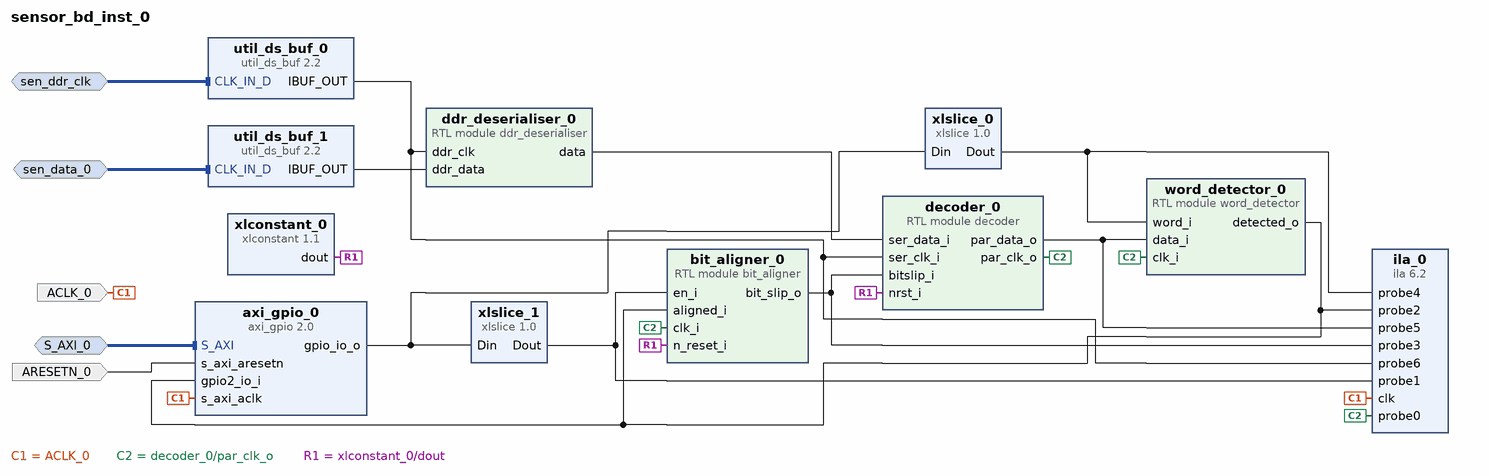
[diagram p0: block diagram of the top level]
# Vivado block design sensor_bd_inst_0, xc7z020clg484-2, Vivado 2023.2
create_bd_design sensor_bd_inst_0

create_bd_intf_port -mode Slave -vlnv xilinx.com:interface:aximm_rtl:1.0 S_AXI_0
create_bd_intf_port -mode Slave -vlnv xilinx.com:interface:diff_clock_rtl:1.0 sen_ddr_clk
create_bd_intf_port -mode Slave -vlnv xilinx.com:interface:diff_clock_rtl:1.0 sen_data_0
create_bd_port -dir I -type clk ACLK_0
create_bd_port -dir I -type rst ARESETN_0

create_bd_cell -type ip -vlnv xilinx.com:ip:axi_gpio:2.0 axi_gpio_0
set_property -dict [list \
  CONFIG.C_ALL_INPUTS 0 \
  CONFIG.C_ALL_INPUTS_2 1 \
  CONFIG.C_ALL_OUTPUTS 1 \
  CONFIG.C_GPIO2_WIDTH 1 \
  CONFIG.C_GPIO_WIDTH 13 \
  CONFIG.C_IS_DUAL 1 \
] [get_bd_cells axi_gpio_0]
create_bd_cell -type ip -vlnv xilinx.com:ip:util_ds_buf:2.2 util_ds_buf_0
create_bd_cell -type ip -vlnv xilinx.com:ip:util_ds_buf:2.2 util_ds_buf_1
create_bd_cell -type ip -vlnv xilinx.com:ip:xlslice:1.0 xlslice_0
set_property -dict {CONFIG.DIN_FROM 11 CONFIG.DIN_WIDTH 13} [get_bd_cells xlslice_0]
create_bd_cell -type ip -vlnv xilinx.com:ip:xlslice:1.0 xlslice_1
set_property -dict {CONFIG.DIN_FROM 12 CONFIG.DIN_TO 12 CONFIG.DIN_WIDTH 13} [get_bd_cells xlslice_1]
create_bd_cell -type ip -vlnv xilinx.com:ip:ila:6.2 ila_0
set_property -dict [list \
  CONFIG.C_DATA_DEPTH 8192 \
  CONFIG.C_MONITOR_TYPE Native \
  CONFIG.C_NUM_OF_PROBES 7 \
  CONFIG.C_PROBE2_WIDTH 1 \
  CONFIG.C_PROBE3_WIDTH 1 \
  CONFIG.C_PROBE4_WIDTH 12 \
  CONFIG.C_PROBE5_WIDTH 12 \
] [get_bd_cells ila_0]
create_bd_cell -type module -reference word_detector word_detector_0
create_bd_cell -type module -reference bit_aligner bit_aligner_0
set_property -dict {CONFIG.HOLD_OFF_CYCLES 32} [get_bd_cells bit_aligner_0]
create_bd_cell -type module -reference decoder decoder_0
set_property -dict {CONFIG.DIV 12} [get_bd_cells decoder_0]
create_bd_cell -type module -reference ddr_deserialiser ddr_deserialiser_0
create_bd_cell -type ip -vlnv xilinx.com:ip:xlconstant:1.1 xlconstant_0

# ---- connections ----

connect_bd_intf_net -intf_net CLK_IN_D_0_1 [get_bd_intf_ports sen_data_0] [get_bd_intf_pins util_ds_buf_1/CLK_IN_D]
connect_bd_intf_net -intf_net S_AXI_0_1 [get_bd_intf_ports S_AXI_0] [get_bd_intf_pins axi_gpio_0/S_AXI]
connect_bd_intf_net -intf_net diff_clk_in_0_1 [get_bd_intf_ports sen_ddr_clk] [get_bd_intf_pins util_ds_buf_0/CLK_IN_D]
connect_bd_net -net ACLK_0_1 [get_bd_ports ACLK_0] [get_bd_pins axi_gpio_0/s_axi_aclk] [get_bd_pins ila_0/clk]
connect_bd_net -net ARESETN_0_1 [get_bd_ports ARESETN_0] [get_bd_pins axi_gpio_0/s_axi_aresetn]
connect_bd_net [get_bd_pins axi_gpio_0/gpio_io_o] [get_bd_pins xlslice_0/Din] [get_bd_pins xlslice_1/Din]
connect_bd_net [get_bd_pins bit_aligner_0/bit_slip_o] [get_bd_pins decoder_0/bitslip_i] [get_bd_pins ila_0/probe3]
connect_bd_net [get_bd_pins ddr_deserialiser_0/data] [get_bd_pins decoder_0/ser_data_i]
connect_bd_net [get_bd_pins decoder_0/par_clk_o] [get_bd_pins word_detector_0/clk_i] [get_bd_pins bit_aligner_0/clk_i] [get_bd_pins ila_0/probe0]
connect_bd_net [get_bd_pins decoder_0/par_data_o] [get_bd_pins word_detector_0/data_i] [get_bd_pins ila_0/probe5]
connect_bd_net [get_bd_pins util_ds_buf_0/IBUF_OUT] \
  [get_bd_pins decoder_0/ser_clk_i] [get_bd_pins ddr_deserialiser_0/ddr_clk] [get_bd_pins ila_0/probe6]
connect_bd_net [get_bd_pins util_ds_buf_1/IBUF_OUT] [get_bd_pins ddr_deserialiser_0/ddr_data]
connect_bd_net [get_bd_pins word_detector_0/detected_o] \
  [get_bd_pins bit_aligner_0/aligned_i] [get_bd_pins ila_0/probe2] [get_bd_pins axi_gpio_0/gpio2_io_i]
connect_bd_net [get_bd_pins xlconstant_0/dout] [get_bd_pins decoder_0/nrst_i] [get_bd_pins bit_aligner_0/n_reset_i]
connect_bd_net [get_bd_pins xlslice_0/Dout] [get_bd_pins word_detector_0/word_i] [get_bd_pins ila_0/probe4]
connect_bd_net [get_bd_pins xlslice_1/Dout] [get_bd_pins bit_aligner_0/en_i] [get_bd_pins ila_0/probe1]

# ---- address map ----
assign_bd_address -offset 0x0000 -range 64K -target_address_space [get_bd_addr_spaces S_AXI_0] [get_bd_addr_segs axi_gpio_0/S_AXI/Reg]

validate_bd_design
save_bd_design
